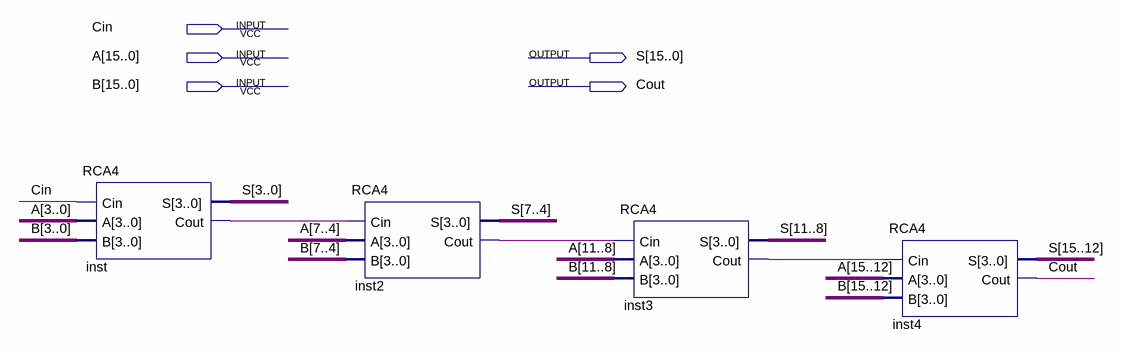
[diagram p0: schematic sheet]
// Quartus schematic RCA16.bdf as structural Verilog: 4 symbols, 5 pins
module RCA16 (
  input  Cin,
  input  [15:0] A,
  input  [15:0] B,
  output [15:0] S,
  output Cout
);

  wire inst2_cout, inst3_cout, inst_cout;

  RCA4 inst (.Cin(Cin), .A(A[3:0]), .B(B[3:0]), .S(S[3:0]), .Cout(inst_cout));
  RCA4 inst2 (.Cin(inst_cout), .A(A[7:4]), .B(B[7:4]), .S(S[7:4]), .Cout(inst2_cout));
  RCA4 inst3 (.Cin(inst2_cout), .A(A[11:8]), .B(B[11:8]), .S(S[11:8]), .Cout(inst3_cout));
  RCA4 inst4 (.Cin(inst3_cout), .A(A[15:12]), .B(B[15:12]), .S(S[15:12]), .Cout(Cout));
endmodule
